# Altium schematic sheet ACCTRL_OPTOTRIAC.SchDoc
size A3; SheetNumber: 3; SheetTotal: 10
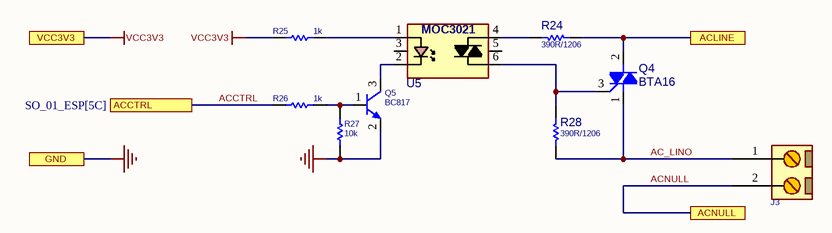
[diagram p0: ACCTRL_OPTOTRIAC.SchDoc]

## Parts
J3  CONN_TB2  [MSTB_2]  (value not drawn)
Q4  BTA16  [TO220_3]
Q5  BC817  [SOT23_3]
R24  390R/1206  [R1206]
R25  1k  [R0603]
R26  1k  [R0603]
R27  10k  [R0603]
R28  390R/1206  [R1206]
U5  MOC3021  [DIP_6SMD]  (value not drawn)

## Ports
ACCTRL (see SO_01_ESP[5C]), ACLINE, ACNULL, GND, VCC3V3

## Nets
GND: Q5.2(E) R27.1 ; port GND
VCC3V3: R25.1 ; port VCC3V3
AC_LINO: J3.1 Q4.1(T1) R28.1
ACCTRL: R26.1 ; port ACCTRL
ACLINE: Q4.2(T2) R24.1 ; port ACLINE
ACNULL: J3.2 ; port ACNULL
NetQ4_3: Q4.3(G) R28.2 U5.6(A/K)
NetQ5_1: Q5.1(B) R26.2 R27.2
NetQ5_3: Q5.3(C) U5.2(K)
NetR24_2: R24.2 U5.4(A/K)
NetR25_2: R25.2 U5.1(A)

Not connected (* = marked no-connect by the designer): U5 3(NC) 5(NC)

## Library data of the parts
J3 = CONN_MSTB_2: CONN, PHOENIX MSTB, 5-G, 5.08mm pitch; PARAM2: 320V; PARAM: 12A; VALUE: CONN_TB2
Q4 = TRIAC_BTA16-800_TO220: Triac, 800V, 16A, TO-220; MANF_P#: BTA16-800CW; MANF: ST; PRICE: 1200toman@PAYA; VALUE: BTA16
Q5 = NPN_BC817_SOT23: BJT, NPN, 45v, 0.5A, SMD, SOT23; PARAM: 0.5A, Hfe100~600; PARAM2: 45v, 250mW; MANF: NXP, ON; MANF_P#: BC817; VALUE: BC817
R24 R28 = RES_SMD_1206: RESISTOR, SMD, 1206; PARAM: -W; DESC: DESCRIPTION; DIST#: MOUSER; PARAM2: 1%; MANF_P#: -; MANF: -; ASSEMBLY: ASSEMBLY; PRICE: 100= 0.5$; VALUE: 390R/1206
R25-R27 = RES_SMD_0603: RESISTOR, SMD; PARAM: -W; DESC: DESCRIPTION; DIST#: MOUSER; PARAM2: 1%; MANF_P#: -; MANF: -; ASSEMBLY: ASSEMBLY; PRICE: 100= 0.5$
U5 = OPT_TRIAC6P_MOC3021_SMD: OPTOTRIAC, 400v/1A; MANF_P#: MOC3021-3; PARAM2: 300mW, -40~85°C; PARAM: 3v/60mA IN/ 400v/1A out; PRICE: 3t@paya; VALUE: MOC3021